# Altium project Motor_control.PrjPcb
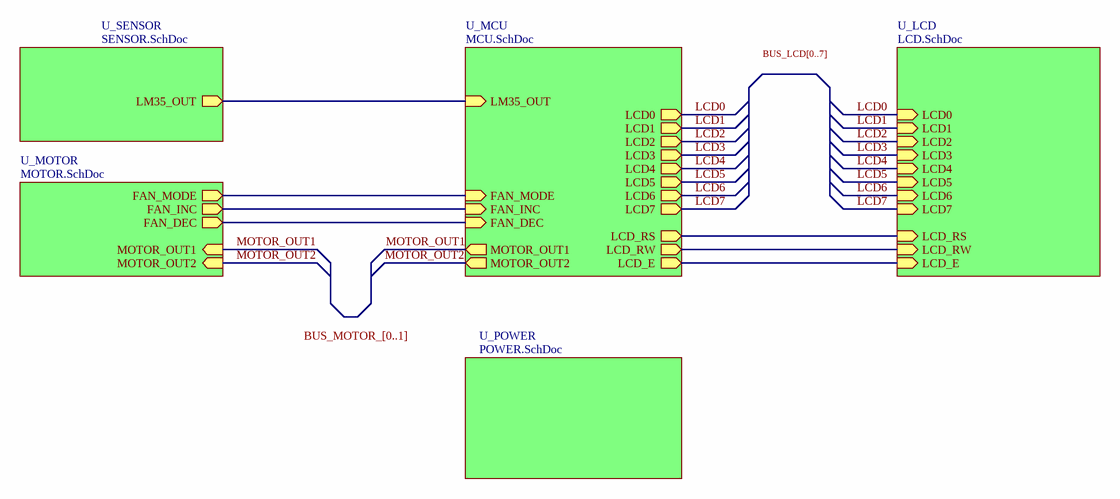
[diagram p0: MAIN.SchDoc]
2 sheets, 14 parts. Net scope: hierarchical (ports join the sheet entries above them; power ports are global).
Board file: PCB_Motor_controller.PcbDoc
Sheets:
  MAIN.SchDoc
    U_MCU = MCU.SchDoc

## Sheet MAIN.SchDoc
size A4; Author: Khanh BK; Organization: DB Bach Khoa HN; Address1: Bach Khoa- HBT - HN; Address2: khanh.db192932; Address3: Youtube: Đào Bá Khánh; Address4: 0357698570; Revision: 1.0Ver; SheetNumber: 1; SheetTotal: 6

### Sub-sheets
U_LCD = LCD.SchDoc (file not in this document): LCD0 (in), LCD1 (in), LCD2 (in), LCD3 (in), LCD4 (in), LCD5 (in), LCD6 (in), LCD7 (in), LCD_RS (in), LCD_RW (in), LCD_E (in)
U_MCU = MCU.SchDoc: LM35_OUT (in), MOTOR_OUT1 (out), MOTOR_OUT2 (out), FAN_MODE (in), FAN_INC (in), FAN_DEC (in), LCD0 (out), LCD1 (out), LCD2 (out), LCD3 (out), LCD4 (out), LCD5 (out), LCD6 (out), LCD7 (out), LCD_RS (out), LCD_RW (out), LCD_E (out)
U_MOTOR = MOTOR.SchDoc (file not in this document): MOTOR_OUT1 (in), MOTOR_OUT2 (in), FAN_MODE (out), FAN_INC (out), FAN_DEC (out)
U_POWER = POWER.SchDoc (file not in this document): no entries
U_SENSOR = SENSOR.SchDoc (file not in this document): LM35_OUT (out)

### Nets
FAN_DEC: sheet U_MCU/FAN_DEC, sheet U_MOTOR/FAN_DEC
FAN_INC: sheet U_MCU/FAN_INC, sheet U_MOTOR/FAN_INC
FAN_MODE: sheet U_MCU/FAN_MODE, sheet U_MOTOR/FAN_MODE
LCD0: sheet U_MCU/LCD0, sheet U_LCD/LCD0
LCD1: sheet U_MCU/LCD1, sheet U_LCD/LCD1
LCD2: sheet U_MCU/LCD2, sheet U_LCD/LCD2
LCD3: sheet U_MCU/LCD3, sheet U_LCD/LCD3
LCD4: sheet U_MCU/LCD4, sheet U_LCD/LCD4
LCD5: sheet U_MCU/LCD5, sheet U_LCD/LCD5
LCD6: sheet U_MCU/LCD6, sheet U_LCD/LCD6
LCD7: sheet U_MCU/LCD7, sheet U_LCD/LCD7
LCD_E: sheet U_MCU/LCD_E, sheet U_LCD/LCD_E
LCD_RS: sheet U_MCU/LCD_RS, sheet U_LCD/LCD_RS
LCD_RW: sheet U_MCU/LCD_RW, sheet U_LCD/LCD_RW
LM35_OUT: sheet U_MCU/LM35_OUT, sheet U_SENSOR/LM35_OUT
MOTOR_OUT1: sheet U_MCU/MOTOR_OUT1, sheet U_MOTOR/MOTOR_OUT1
MOTOR_OUT2: sheet U_MCU/MOTOR_OUT2, sheet U_MOTOR/MOTOR_OUT2

### Notes on the sheet
- BUS_LCD[0..7]
- BUS_MOTOR_[0..1]
- Title
- Size:
- Date:
- Author:
- A4
- Time:
- Number:
- Checked:
- Revision:
- Sheet
- Approved:
- of
- File:

## Sheet MCU.SchDoc
size A4; Author: Khanh BK; Organization: DB Bach Khoa HN; Address1: Bach Khoa- HBT - HN; Address2: khanh.db192932; Address3: Youtube: Đào Bá Khánh; Address4: 0357698570; Revision: 1.0Ver; SheetNumber: 2; SheetTotal: 6
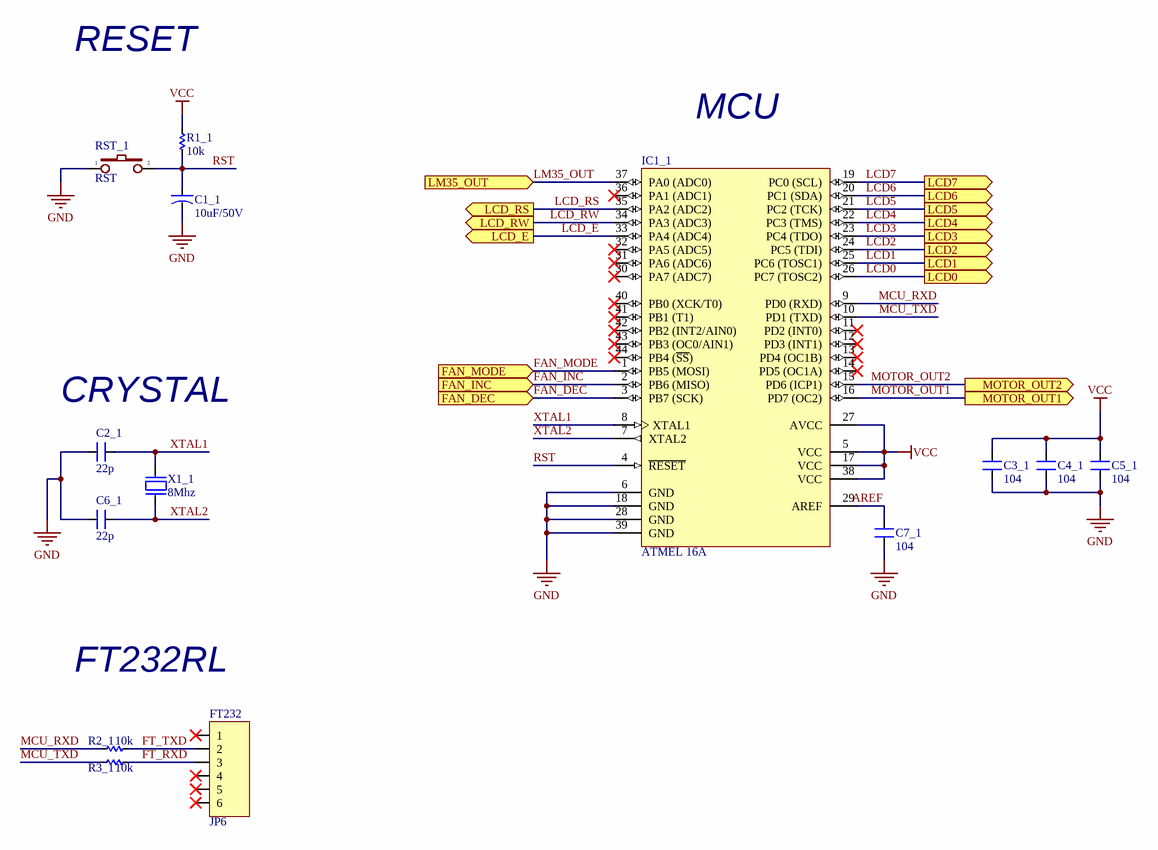
[diagram p1: MCU.SchDoc]

### Parts
C1_1  10uF/50V  [CAP-ALU-SMD-5.5x5.5]
C2_1  22p  [CN-SMD-0805]
C3_1  104  [CN-SMD-0805]
C4_1  104  [CN-SMD-0805]
C5_1  104  [CN-SMD-0805]
C6_1  22p  [CN-SMD-0805]
C7_1  104  [CN-SMD-0805]
FT232  JP6  [JP6-C1T]
IC1_1  ATMEL 16A  [TQFP44]
R1_1  10k  [RES-SMD-0805]
R2_1  10k  [RES-SMD-0805]
R3_1  10k  [RES-SMD-0805]
RST_1  RST  [SW1-SMD]
X1_1  8Mhz  [XT2]

### Ports
FAN_DEC (in), FAN_INC (in), FAN_MODE (in), LCD0 (out), LCD1 (out), LCD2 (out), LCD3 (out), LCD4 (out), LCD5 (out), LCD6 (out), LCD7 (out), LCD_E (out), LCD_RS (out), LCD_RW (out), LM35_OUT (in), MOTOR_OUT1 (out), MOTOR_OUT2 (out)

### Nets
GND: C1_1.2 C2_1.2 C3_1.1 C4_1.1 C5_1.1 C6_1.2 C7_1.1 IC1_1.6(GND) IC1_1.18(GND) IC1_1.28(GND) IC1_1.39(GND) RST_1.1
VCC: C3_1.2 C4_1.2 C5_1.2 IC1_1.5(VCC) IC1_1.17(VCC) IC1_1.27(AVCC) IC1_1.38(VCC) R1_1.1
AREF: C7_1.2 IC1_1.29(AREF)
FAN_DEC: IC1_1.3(PB7_(SCK)) ; port FAN_DEC
FAN_INC: IC1_1.2(PB6_(MISO)) ; port FAN_INC
FAN_MODE: IC1_1.1(PB5_(MOSI)) ; port FAN_MODE
FT_RXD: FT232.3 R3_1.1
FT_TXD: FT232.2 R2_1.1
LCD0: IC1_1.26(PC7_(TOSC2)) ; port LCD0
LCD1: IC1_1.25(PC6_(TOSC1)) ; port LCD1
LCD2: IC1_1.24(PC5_(TDI)) ; port LCD2
LCD3: IC1_1.23(PC4_(TDO)) ; port LCD3
LCD4: IC1_1.22(PC3_(TMS)) ; port LCD4
LCD5: IC1_1.21(PC2_(TCK)) ; port LCD5
LCD6: IC1_1.20(PC1_(SDA)) ; port LCD6
LCD7: IC1_1.19(PC0_(SCL)) ; port LCD7
LCD_E: IC1_1.33(PA4_(ADC4)) ; port LCD_E
LCD_RS: IC1_1.35(PA2_(ADC2)) ; port LCD_RS
LCD_RW: IC1_1.34(PA3_(ADC3)) ; port LCD_RW
LM35_OUT: IC1_1.37(PA0_(ADC0)) ; port LM35_OUT
MCU_RXD: IC1_1.9(PD0_(RXD)) R2_1.2
MCU_TXD: IC1_1.10(PD1_(TXD)) R3_1.2
MOTOR_OUT1: IC1_1.16(PD7_(OC2)) ; port MOTOR_OUT1
MOTOR_OUT2: IC1_1.15(PD6_(ICP1)) ; port MOTOR_OUT2
RST: C1_1.1 IC1_1.4(~{RESET}) R1_1.2 RST_1.2
XTAL1: C2_1.1 IC1_1.8(XTAL1) X1_1.2
XTAL2: C6_1.1 IC1_1.7(XTAL2) X1_1.1

Not connected (* = marked no-connect by the designer): FT232 1* 4* 5* 6*; IC1_1 11(PD2_(INT0))* 12(PD3_(INT1))* 13(PD4_(OC1B))* 14(PD5_(OC1A))* 30(PA7_(ADC7))* 31(PA6_(ADC6))* 32(PA5_(ADC5))* 36(PA1_(ADC1))* 40(PB0_(XCK/T0))* 41(PB1_(T1))* 42(PB2_(INT2/AIN0))* 43(PB3_(OC0/AIN1))* 44(PB4_(~{SS}))*

### Notes on the sheet
- RESET
- MCU
- (near C2_1) CRYSTAL
- FT232RL
- Title
- Size:
- Date:
- Author:
- A4
- Time:
- Number:
- Checked:
- Revision:
- Sheet
- Approved:
- of
- File:

### Library data of the parts
C1_1 = CN-ALU-SMD: Polarized Capacitor (Axial); Published: 8-Jun-2000; LatestRevisionDate: 17-Jul-2002; LatestRevisionNote: Re-released for DXP Platform.; PackageReference: POLAR0.8; Publisher: Altium Limited
C2_1 C3_1 C4_1 C5_1 C6_1 C7_1 = CN: Value: 33pF
FT232 = JP6: WR-PHD 2.54 mm Angled Socket Header; Manufacturer: W¨¹rth Elektronik eiSos GmbH; partNo: 613006143121; ComponentLink1 Description: Manufacturer; ComponentLink2 Description: Datasheet; NoPins: 06; Created Date: 29 March 2013; ComponentLink1URL: http://www.we-online.com; ComponentLink2URL: http://katalog.we-online.de/em/datasheet/6130xx143121.pdf; Created by: Karrer Zheng
IC1_1 = ATmega16A-AU: 8-bit AVR Microcontroller, 16KB Flash, 512 Bytes EEPROM, 1KB SRAM, 44-pin TQFP, Industrial Grade (-40°C to 85°C); Value: Atmega 16L
R1_1 R2_1 R3_1 = Res-SMD: Resistor; Manufacturer: Generic Components; Class: Passive; Published: 08/06/2000; Publisher: Altium Hobart Technology Centre
RST_1 = SW2: Switch button 2 pin; Value: SW chip 2 pin
X1_1 = XT2: Crystal, 32.768 KHz, -40 to 85 degC, 3.2 x 1.5 x 0.9 mm SMD; Value: 4Mhz